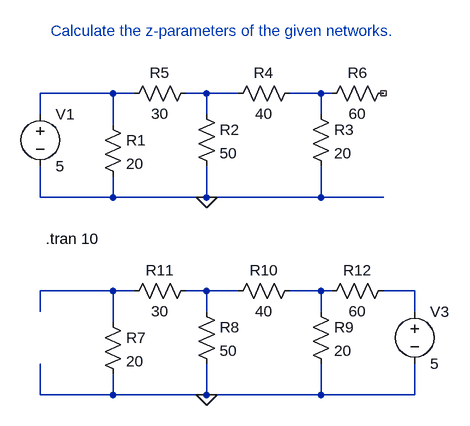
[diagram p0: schematic Lab6_ques3.asc]
Lab6_ques3.asc, the LTspice schematic file:
Version 4
SHEET 1 880 688
WIRE 96 144 -16 144
WIRE 128 144 96 144
WIRE 240 144 208 144
WIRE 288 144 240 144
WIRE 416 144 368 144
WIRE 432 144 416 144
WIRE -16 176 -16 144
WIRE 240 176 240 144
WIRE 416 176 416 144
WIRE 96 192 96 144
WIRE -16 304 -16 256
WIRE 96 304 96 272
WIRE 96 304 -16 304
WIRE 240 304 240 256
WIRE 240 304 96 304
WIRE 416 304 416 256
WIRE 416 304 240 304
WIRE 512 304 416 304
WIRE 96 448 -16 448
WIRE 128 448 96 448
WIRE 240 448 208 448
WIRE 288 448 240 448
WIRE 416 448 368 448
WIRE 432 448 416 448
WIRE 560 448 512 448
WIRE -16 480 -16 448
WIRE 240 480 240 448
WIRE 416 480 416 448
WIRE 560 480 560 448
WIRE 96 496 96 448
WIRE -16 608 -16 560
WIRE 96 608 96 576
WIRE 96 608 -16 608
WIRE 240 608 240 560
WIRE 240 608 96 608
WIRE 416 608 416 560
WIRE 416 608 240 608
WIRE 560 608 560 560
WIRE 560 608 416 608
FLAG 240 304 0
FLAG 240 608 0
SYMBOL Res 80 176 R0
SYMATTR InstName R1
SYMATTR Value 20
SYMBOL Res 224 160 R0
SYMATTR InstName R2
SYMATTR Value 50
SYMBOL Res 400 160 R0
SYMATTR InstName R3
SYMATTR Value 20
SYMBOL Res 384 128 R90
WINDOW 0 0 56 VBottom 2
WINDOW 3 32 56 VTop 2
SYMATTR InstName R4
SYMATTR Value 40
SYMBOL Res 224 128 R90
WINDOW 0 0 56 VBottom 2
WINDOW 3 32 56 VTop 2
SYMATTR InstName R5
SYMATTR Value 30
SYMBOL Res 528 128 R90
WINDOW 0 0 56 VBottom 2
WINDOW 3 32 56 VTop 2
SYMATTR InstName R6
SYMATTR Value 60
SYMBOL Voltage -16 160 R0
SYMATTR InstName V1
SYMATTR Value 5
SYMBOL Res 80 480 R0
SYMATTR InstName R7
SYMATTR Value 20
SYMBOL Res 224 464 R0
SYMATTR InstName R8
SYMATTR Value 50
SYMBOL Res 400 464 R0
SYMATTR InstName R9
SYMATTR Value 20
SYMBOL Res 384 432 R90
WINDOW 0 0 56 VBottom 2
WINDOW 3 32 56 VTop 2
SYMATTR InstName R10
SYMATTR Value 40
SYMBOL Res 224 432 R90
WINDOW 0 0 56 VBottom 2
WINDOW 3 32 56 VTop 2
SYMATTR InstName R11
SYMATTR Value 30
SYMBOL Res 528 432 R90
WINDOW 0 0 56 VBottom 2
WINDOW 3 32 56 VTop 2
SYMATTR InstName R12
SYMATTR Value 60
SYMBOL Voltage 560 464 R0
SYMATTR InstName V3
SYMATTR Value 5
TEXT 0 48 Left 2 ;Calculate the z-parameters of the given networks.
TEXT -8 368 Left 2 !.tran 10

The netlist it stands for:
* Lab6_ques3.asc
R1 N001 0 20
R2 N002 0 50
R3 N003 0 20
R4 N003 N002 40
R5 N002 N001 30
R6 NC_01 N003 60
V1 N001 0 5
R7 N004 0 20
R8 N005 0 50
R9 N006 0 20
R10 N006 N005 40
R11 N005 N004 30
R12 N007 N006 60
V3 N007 0 5
* Calculate the z-parameters of the given networks.
.tran 10
.backanno
.end